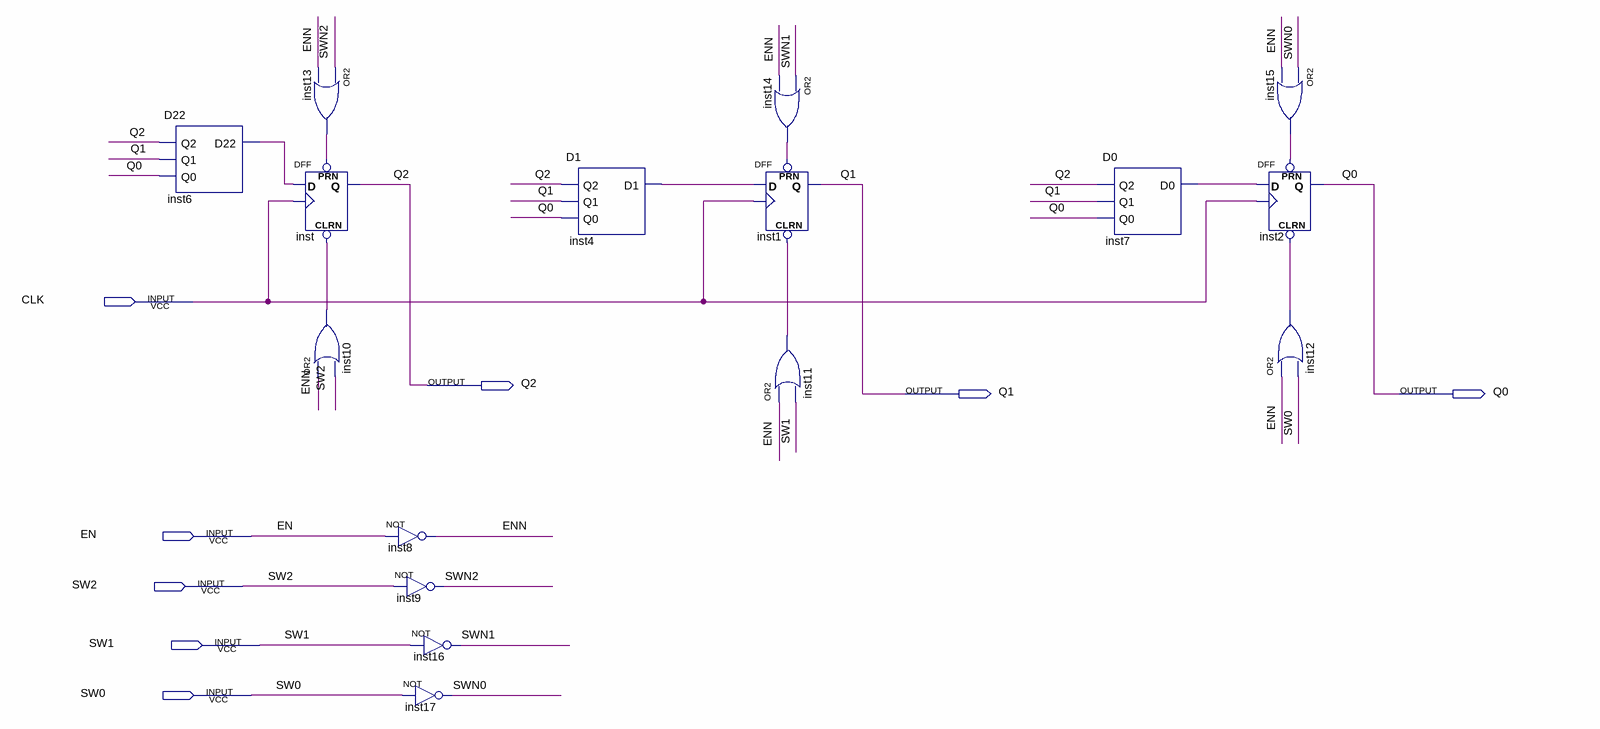
[diagram p0: schematic sheet]
// Quartus schematic DFF_COUNT.bdf as structural Verilog: 16 symbols, 8 pins
module DFF_COUNT (
  input  CLK,
  input  EN,
  input  SW2,
  input  SW1,
  input  SW0,
  output Q2,
  output Q1,
  output Q0
);

  wire ENN, inst4_d1, inst6_d22, inst7_d0, inst10_out, inst11_out, inst12_out, inst13_out, inst14_out,
       inst15_out, SWN0, SWN1, SWN2;

  D22 inst6 (.Q2(Q2), .Q1(Q1), .Q0(Q0), .D22(inst6_d22));
  or inst13 (inst13_out, SWN2, ENN);
  DFF inst (.CLRN(inst10_out), .CLK(CLK), .D(inst6_d22), .PRN(inst13_out), .Q(Q2));
  or inst10 (inst10_out, ENN, SW2);
  not inst8 (ENN, EN);
  not inst9 (SWN2, SW2);
  not inst17 (SWN0, SW0);
  not inst16 (SWN1, SW1);
  D1 inst4 (.Q2(Q2), .Q1(Q1), .Q0(Q0), .D1(inst4_d1));
  or inst14 (inst14_out, SWN1, ENN);
  DFF inst1 (.CLRN(inst11_out), .CLK(CLK), .D(inst4_d1), .PRN(inst14_out), .Q(Q1));
  or inst11 (inst11_out, ENN, SW1);
  D0 inst7 (.Q2(Q2), .Q1(Q1), .Q0(Q0), .D0(inst7_d0));
  or inst15 (inst15_out, SWN0, ENN);
  DFF inst2 (.CLRN(inst12_out), .CLK(CLK), .D(inst7_d0), .PRN(inst15_out), .Q(Q0));
  or inst12 (inst12_out, ENN, SW0);
endmodule
